# EAGLE design Un_Arduino_old (EAGLE 6.5.0)
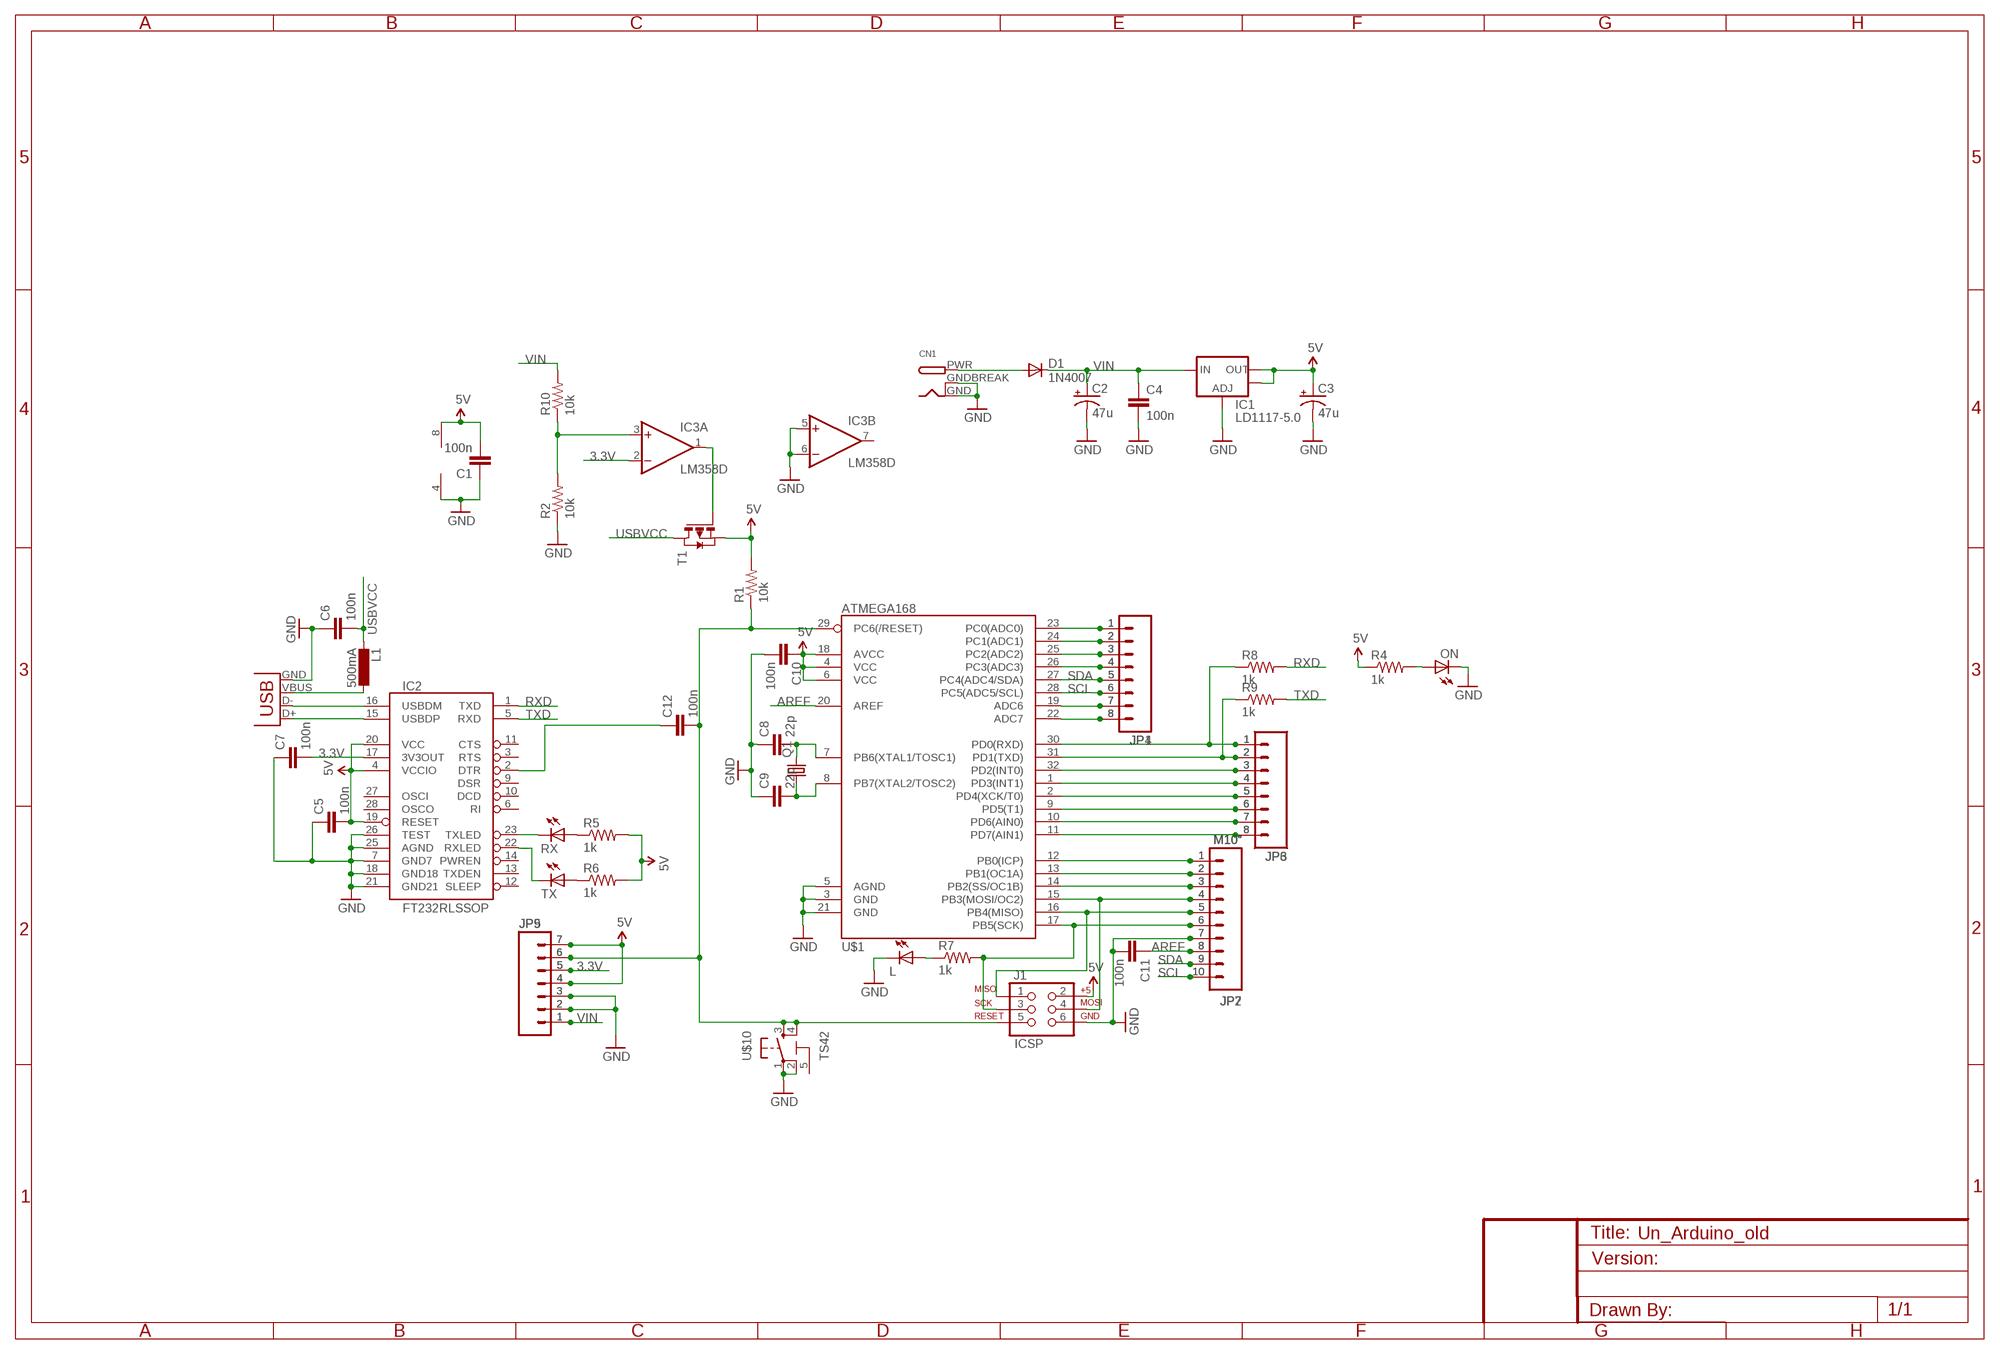
[diagram p0: schematic, sheet 1]

## Parts
C1  100n  CAP0603-CAP  [0603-CAP]
C2  47u  CAP_POLD  [PANASONIC_D]
C3  47u  CAP_POLD  [PANASONIC_D]
C4  100n  CAP0603-CAP  [0603-CAP]
C5  100n  CAP0603-CAP  [0603-CAP]
C6  100n  CAP0603-CAP  [0603-CAP]
C7  100n  CAP0603-CAP  [0603-CAP]
C8  22p  CAP0805  [0805]
C9  22p  CAP0805  [0805]
C10  100n  CAP0603-CAP  [0603-CAP]
C11  100n  CAP0603-CAP  [0603-CAP]
C12  100n  CAP0603-CAP  [0603-CAP]
CN1  DCBARRELPTH  [DCJACK_2MM_PTH]
D1  1N4007  DIODE-SMB  [SMB]
IC1  LD1117-5.0  V_REG_LM1117SOT223  [SOT223]
IC2  FT232RLSSOP  [SSOP28DB]
IC3  LM358D  [SO08]
J1  ICSP  AVR_SPI_PRG_6PTH  [2X3]
JP1  M081X08  [1X08]
JP2  M10"  [1X10]
JP3  M08  [1X08]
JP4  M081X08  [1X08]
JP5  M07  [1X07]
JP6  M08  [1X08]
JP7  M10"  [1X10]
JP9  M07  [1X07]
L  LED0805  [LED-0805]
L1  500mA  L-EUL1812  [L1812]
ON  LED0805  [LED-0805]
Q1  CRYSTALHC49US  [HC49US]
R1  10k  RESISTOR0805-RES  [0805]
R2  10k  RESISTOR0805-RES  [0805]
R4  1k  RESISTOR0805-RES  [0805]
R5  1k  RESISTOR0805-RES  [0805]
R6  1k  RESISTOR0805-RES  [0805]
R7  1k  RESISTOR0805-RES  [0805]
R8  1k  RESISTOR0805-RES  [0805]
R9  1k  RESISTOR0805-RES  [0805]
R10  10k  RESISTOR0805-RES  [0805]
RX  LED0805  [LED-0805]
T1  PMOSSOT23  [SOT-23]
TX  LED0805  [LED-0805]
U$1  ATMEGA168  [TQFP32-08]
U$10  TS42  [TS42]
X1  USBPTH  [USB-B-PTH]

## Nets
3.3V: C7.2 IC2.17(3V3OUT) IC3.2(A:-IN) JP5.5 JP9.5
5V: C1.2 C3.+ C5.2 C10.1 IC1.2(OUT) IC1.4(OUT) IC2.4(VCCIO) IC2.19(RESET) IC2.20(VCC) IC3.8(P:V+) J1.2 JP5.4 JP5.7 JP9.4 JP9.7 R1.2 R4.1 R5.2 R6.2 T1.2(S) U$1.4(VCC) U$1.6(VCC) U$1.18(AVCC)
A0: JP1.1 JP4.1 U$1.23(PC0(ADC0))
AREF: C11.1 JP2.8 JP7.8 U$1.20(AREF)
GND: C1.1 C2.- C3.- C4.2 C5.1 C6.1 C7.1 C8.1 C9.1 C10.2 C11.2 CN1.GND CN1.GNDBREAK IC1.1(ADJ) IC2.7(GND7) IC2.18(GND18) IC2.21(GND21) IC2.25(AGND) IC2.26(TEST) IC3.4(P:V-) IC3.5(B:+IN) IC3.6(B:-IN) J1.6 JP2.7 JP5.2 JP5.3 JP7.7 JP9.2 JP9.3 L.2(C) ON.2(C) R2.1 U$1.3(GND) U$1.5(AGND) U$1.21(GND) U$10.1 U$10.2 X1.GND
IO0: JP3.1 JP6.1 R8.1 U$1.30(PD0(RXD))
N$1: IC3.3(A:+IN) R2.2 R10.1
N$2: IC3.1(A:OUT) T1.3(G)
N$3: L1.1 X1.VBUS
N$4: CN1.PWR D1.A
N$5: IC2.16(USBDM) X1.D-
N$6: IC2.15(USBDP) X1.D+
N$7: R5.1 RX.1(A)
N$8: R6.1 TX.1(A)
N$9: IC2.23(TXLED) RX.2(C)
N$10: IC2.22(RXLED) TX.2(C)
N$12: JP1.7 JP4.7 U$1.19(ADC6)
N$13: JP1.8 JP4.8 U$1.22(ADC7)
N$14: L.1(A) R7.1
N$15: C12.1 IC2.2(DTR)
N$16: JP2.1 JP7.1 U$1.12(PB0(ICP))
N$17: JP2.2 JP7.2 U$1.13(PB1(OC1A))
N$18: JP2.3 JP7.3 U$1.14(PB2(SS/OC1B))
N$19: J1.4 JP2.4 JP7.4 U$1.15(PB3(MOSI/OC2))
N$20: J1.1 JP2.5 JP7.5 U$1.16(PB4(MISO))
N$23: JP3.2 JP6.2 R9.1 U$1.31(PD1(TXD))
N$24: JP3.3 JP6.3 U$1.32(PD2(INT0))
N$25: JP3.4 JP6.4 U$1.1(PD3(INT1))
N$26: JP3.5 JP6.5 U$1.2(PD4(XCK/T0))
N$27: JP3.6 JP6.6 U$1.9(PD5(T1))
N$28: JP3.7 JP6.7 U$1.10(PD6(AIN0))
N$29: JP3.8 JP6.8 U$1.11(PD7(AIN1))
N$31: JP1.2 JP4.2 U$1.24(PC1(ADC1))
N$32: JP1.3 JP4.3 U$1.25(PC2(ADC2))
N$33: JP1.4 JP4.4 U$1.26(PC3(ADC3))
N$34: ON.1(A) R4.2
N$38: C12.2 J1.5 JP5.6 JP9.6 R1.1 U$1.29(PC6(/RESET)) U$10.3 U$10.4
N$39: C8.2 Q1.2 U$1.7(PB6(XTAL1/TOSC1))
N$40: C9.2 Q1.1 U$1.8(PB7(XTAL2/TOSC2))
RXD: IC2.1(TXD) R8.2
SCK: J1.3 JP2.6 JP7.6 R7.2 U$1.17(PB5(SCK))
SCL: JP1.6 JP2.10 JP4.6 JP7.10 U$1.28(PC5(ADC5/SCL))
SDA: JP1.5 JP2.9 JP4.5 JP7.9 U$1.27(PC4(ADC4/SDA))
TXD: IC2.5(RXD) R9.2
USBVCC: C6.2 L1.2 T1.1(D)
VIN: C2.+ C4.1 D1.C IC1.3(IN) JP5.1 JP9.1 R10.2
Unconnected: IC2.3(RTS) IC2.6(RI) IC2.9(DSR) IC2.10(DCD) IC2.11(CTS) IC2.12(SLEEP) IC2.13(TXDEN) IC2.14(PWREN) IC2.27(OSCI) IC2.28(OSCO) IC3.7(B:OUT) U$10.5

## Library data of the parts
C1 C4-C12 = 1SparkFun:CAP: Capacitor Standard 0603 ceramic capacitor, and 0.1" leaded capacitor.
C2 C3 = 1SparkFun:CAP_POL: Capacitor Polarized These are standard SMD and PTH capacitors. Normally 10uF, 47uF, and 100uF in electrolytic and tantalum varieties. Always verify the external diameter of the through hole cap, it varies with capacity, voltage, and manufacturer. The EIA devices should be standard.
CN1 = 1adafruit:DCBARREL: 2.0mm DC Barrel Jack DCJACK_2MM_PTH - Through Hole Jack (4UConnector: 05537)
D1 = diode:DIODE-: DIODE
IC1 = 1SparkFun:V_REG_LM1117: Voltage Regulator LM1117 Standard adjustable voltage regulator but in SMD form. Spark Fun Electronics SKU : COM-00595
IC2 = 1SparkFun:FT232RL: USB UART FT232RL 4th Generation USB UART (USB <-> Serial) Controller. Spark Fun Electronics SKU : COM-00650
IC3 = linear:LM358: OP AMP also LM158; LM258; LM2904 Source: http://cache.national.com/ds/LM/LM158.pdf
J1 = 1SparkFun:AVR_SPI_PRG_6: AVR ISP 6 Pin This is the reduced ISP connector for AVR programming. Common on Arduino. This footprint will take up less PCB space and can be used with a 10-pin to 6-pin adapter such as SKU: BOB-08508
JP1 JP4 = 2SparkFun:M08: Header 8 Standard 8-pin 0.1" header. Use with straight break away headers (SKU : PRT-00116), right angle break away headers (PRT-00553), swiss pins (PRT-00743), machine pins (PRT-00117), and female headers (PRT-00115).
JP2 JP7 = 1SparkFun:M10: Header 10 Standard 10-pin 0.1" header. Use with straight break away headers (SKU : PRT-00116), right angle break away headers (PRT-00553), swiss pins (PRT-00743), machine pins (PRT-00117), and female headers (PRT-00115).
JP3 JP6 = 1SparkFun:M08: Header 8 Standard 8-pin 0.1" header. Use with straight break away headers (SKU : PRT-00116), right angle break away headers (PRT-00553), swiss pins (PRT-00743), machine pins (PRT-00117), and female headers (PRT-00115).
JP5 JP9 = 2SparkFun:M07: Header 7 Standard 7-pin 0.1" header. Use with straight break away headers (SKU : PRT-00116), right angle break away headers (PRT-00553), swiss pins (PRT-00743), machine pins (PRT-00117), and female headers (PRT-00115). NOTES ON THE VARIANTS LOCK and LOCK_LONGPADS... This footprint was designed to help hold the alignment of a through-hole component (i.e. 7-pin header) while soldering it into place. You may notice that each hole has been shifted either up or down by 0.005 of an inch from it's more standard position (which is usually a perfectly straight line). This slight alteration caused the pins (the squares in the middle) to touch the edges of the holes. Because they are alternating, it causes a "brace" to hold the header in place. 0.005 has proven to be the perfect amount of "off-center" position when using our standard breakaway headers. Although looks a little odd when you look at the bare footprint, once you have a header in there, the alteration is very hard to notice. Also, if you push a header all the way into place, it is covered up entirely on the bottom side. This idea of altering the position of holes to aid alignment will be further integrated into the Sparkfun Library for other footprints. It can help hold any component with 3 or more connection pins.
L ON RX TX = 1SparkFun:LED: LEDs Standard schematic elements and footprints for 5mm, 3mm, 1206, and 0603 sized LEDs. 5mm - Spark Fun Electronics SKU : COM-00529 (and others)
L1 = rcl:L-EU: INDUCTOR, European symbol
Q1 = 1SparkFun:CRYSTAL: Crystals Various standard crystals. Proven footprints. Spark Fun Electronics SKU : COM-00534
R1 R2 R4-R10 = 2SparkFun:RESISTOR: Resistor Basic schematic elements and footprints for 0603, 1206, and PTH resistors.
T1 = zetex:PMOSSOT23: MOS FET; OC_FARNELL: unknown; OC_NEWARK: unknown
U$1 = 1SparkFun:ATMEGA168
U$10 = 2SparkFun:TS42
X1 = 1SparkFun:USB: USB Connectors USB-B-PTH is fully proven SKU : PRT-00139 USB-miniB is fully proven SKU : PRT-00587 USB-A-PCB is untested. USB-A-H is throughly reviewed, but untested. Spark Fun Electronics SKU : PRT-00437 USB-B-SMT is throughly reviewed, but untested. Needs silkscreen touching up. USB-A-S has not been used/tested USB-MB-H has not been used/tested

## Net classes
0 default: width 0.254 mm, clearance 0.254 mm
1 power: width 0.61 mm, drill 0.61 mm, clearance 0.254 mm
2 gnd: width 0.305 mm, drill 0.559 mm, clearance 0.254 mm
3 usbvcc: width 0.508 mm, drill 0.61 mm, clearance 0.254 mm
4 aref: width 0.406 mm, drill 0.61 mm, clearance 0.254 mm

## Board
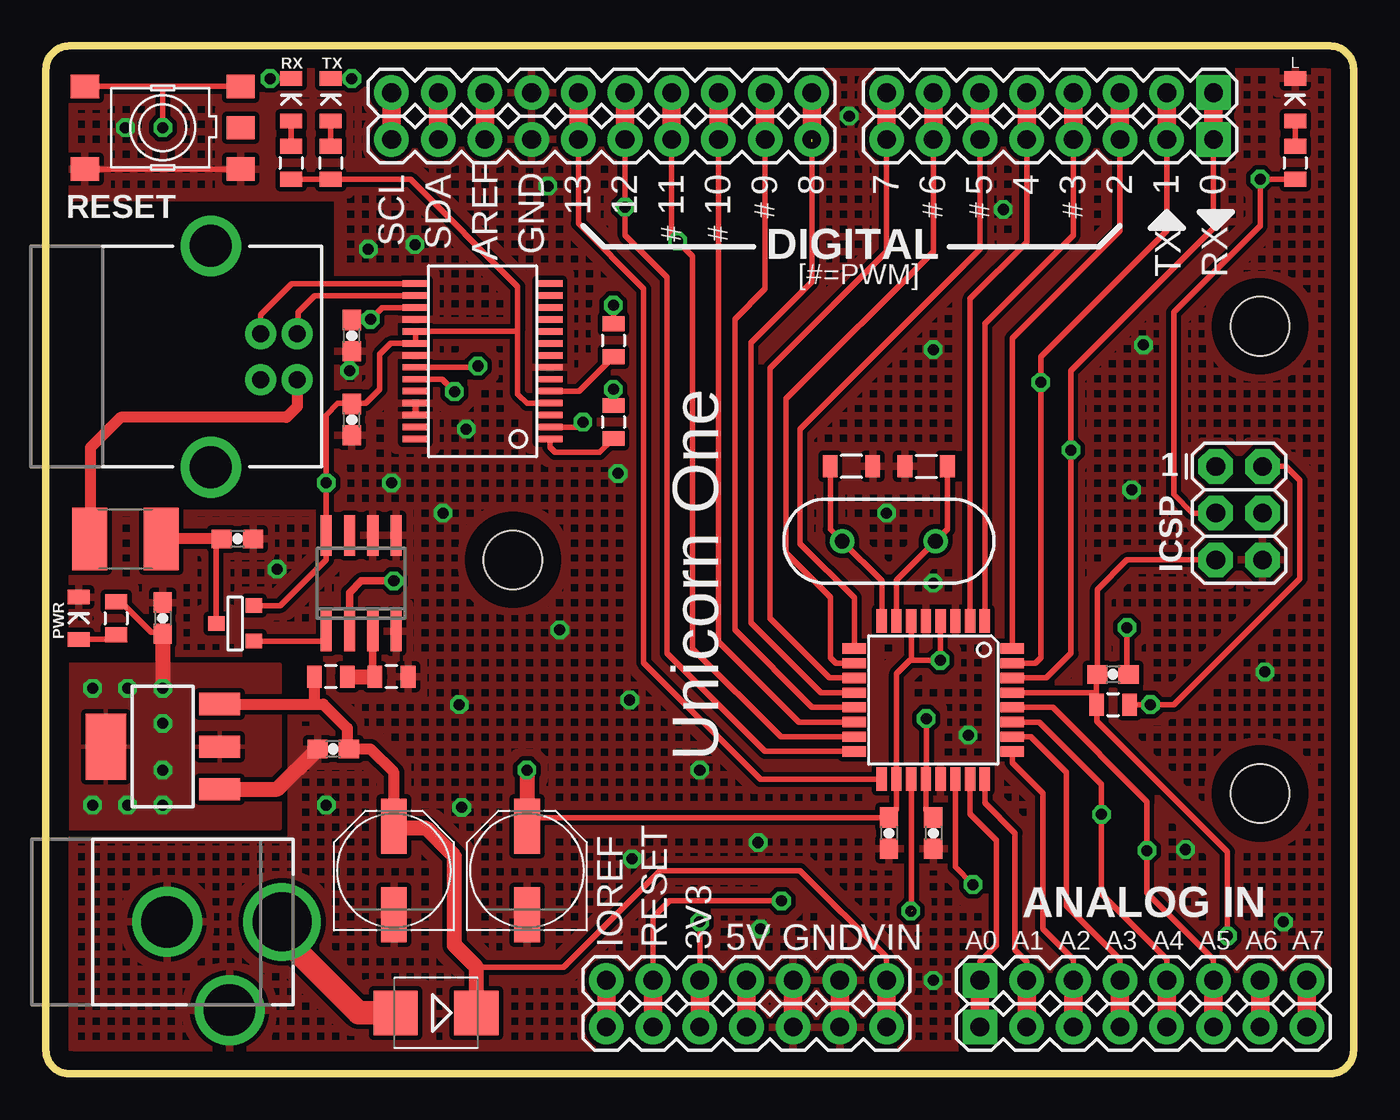
[diagram p1: board, top side]
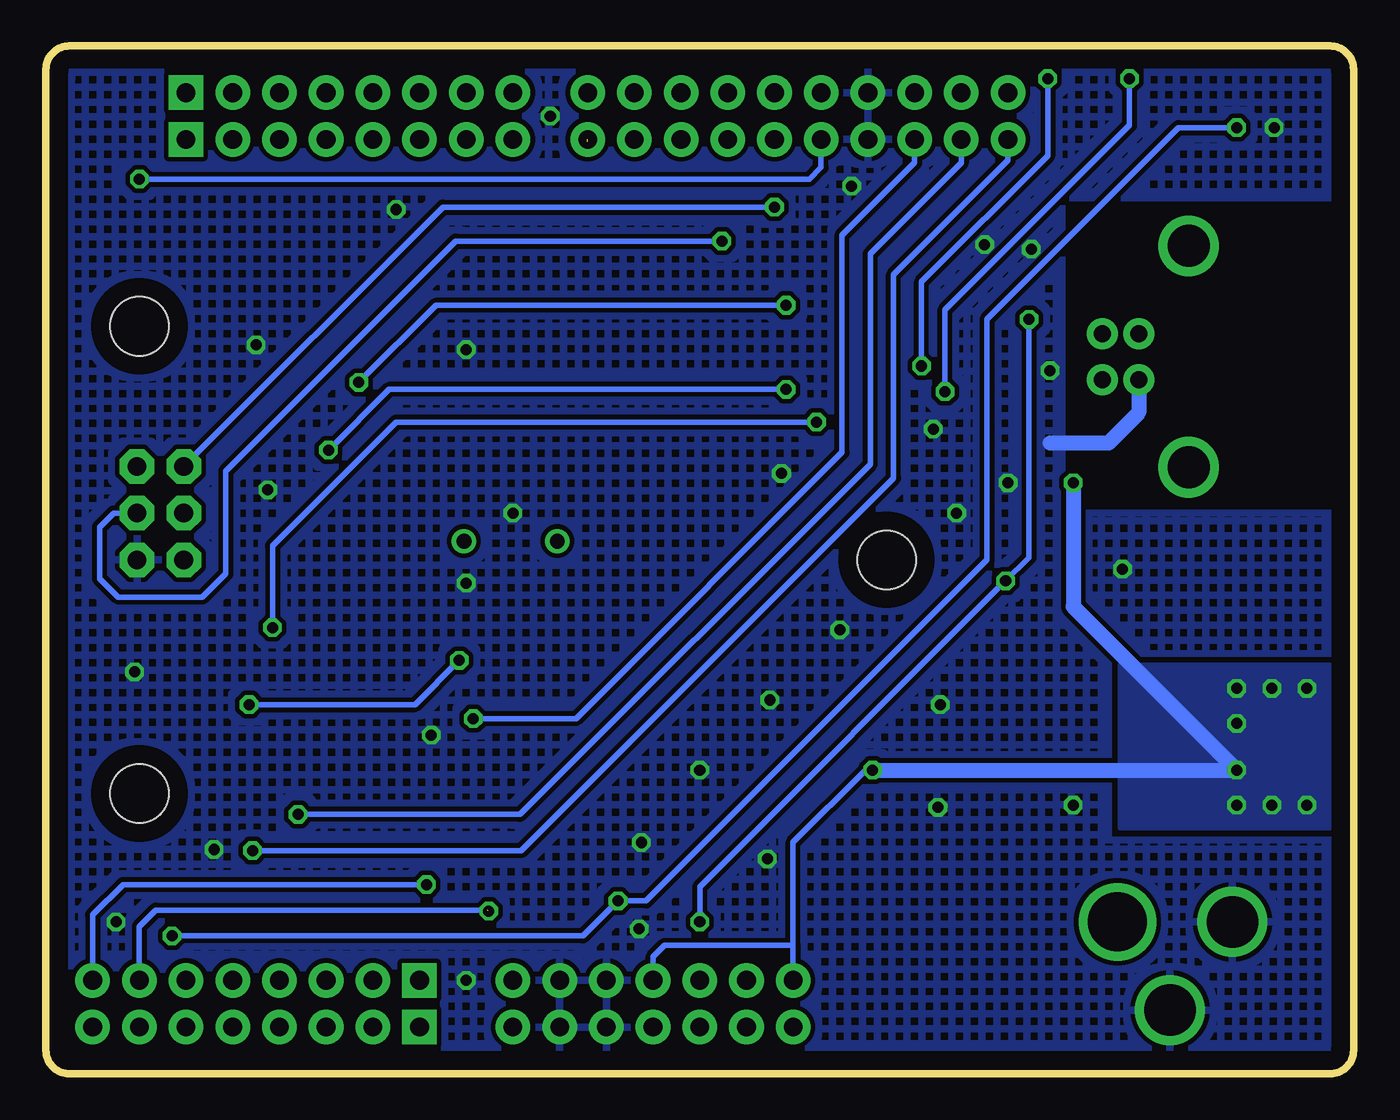
[diagram p2: board, bottom side, seen from below]

Size 71.12 x 55.88 mm. Coordinates in mm from the lower left corner, seen from the top.
Outline: 1.27,0 69.85,0 arc90 71.12,1.27 71.12,54.61 arc90 69.85,55.88 1.27,55.88 arc90 0,54.61 0,1.27 arc90 1.27,0
Copper layers (1*16): Top 0.035mm / dielectric 1.5mm / Bottom 0.035mm
Design rules "default": minimum track width 10mil, minimum drill 24mil, track to track 8mil, track to pad 8mil, pad to pad 8mil, via to via 8mil, smd to smd 8mil, copper to edge 40mil, drill to drill 8mil, minimum pad ring 10mil, minimum via ring 8mil, stop-mask expansion 4mil, vias tented up to drill 0mil, thermal gap 10mil
Holes 3.2 mm at 66.04,40.64 66.04,15.24 25.4,27.94

### Footprints (pad centres in the part's own frame; a part is rotated, then mirrored left to right if it is on the bottom)
0603-CAP = smd 1.1 x 1: 1 -0.85,0; 2 0.85,0
PANASONIC_D = smd 3 x 1.4: + 2.4,0; - -2.4,0
0805 = smd 0.8 x 1.2: 1 -1.154,0; 2 1.154,0
DCJACK_2MM_PTH = drill 2.8: GND 0,7.35; GNDBREAK 4.8,10.75 | drill 3.2: PWR 0,13.6
SMB = smd 2.4 x 2.4: A 2.2,0; C -2.2,0
SOT223 = smd 1.219 x 2.235: 1 -2.311,-3.099; 2 0,-3.099; 3 2.311,-3.099 | smd 3.6 x 2.2: 4 0,3.099
SSOP28DB = smd 0.348 x 1.397: 1 -4.225,-3.656; 2 -3.575,-3.656; 3 -2.925,-3.656; 4 -2.275,-3.656; 5 -1.625,-3.656; 6 -0.975,-3.656; 7 -0.325,-3.656; 8 0.325,-3.656; 9 0.975,-3.656; 10 1.625,-3.656; 11 2.275,-3.656; 12 2.925,-3.656; 13 3.575,-3.656; 14 4.225,-3.656; 15 4.225,3.656; 16 3.575,3.656; 17 2.925,3.656; 18 2.275,3.656; 19 1.625,3.656; 20 0.975,3.656; 21 0.325,3.656; 22 -0.325,3.656; 23 -0.975,3.656; 24 -1.625,3.656; 25 -2.275,3.656; 26 -2.925,3.656; 27 -3.575,3.656; 28 -4.225,3.656
SO08 = smd 0.6 x 2.2: 1 -1.905,-2.6; 2 -0.635,-2.6; 3 0.635,-2.6; 4 1.905,-2.6; 5 1.905,2.6; 6 0.635,2.6; 7 -0.635,2.6; 8 -1.905,2.6
2X3 = drill 1.016 pad 1.88 octagon: 1 0,0; 2 0,2.54; 3 2.54,0; 4 2.54,2.54; 5 5.08,0; 6 5.08,2.54
1X08 = drill 1.016 pad 1.88 square: 1 0,0 | drill 1.016 pad 1.88: 2 2.54,0; 3 5.08,0; 4 7.62,0; 5 10.16,0; 6 12.7,0; 7 15.24,0; 8 17.78,0
1X10 = drill 1.016 pad 1.88: 1 0,0; 2 2.54,0; 3 5.08,0; 4 7.62,0; 5 10.16,0; 6 12.7,0; 7 15.24,0; 8 17.78,0; 9 20.32,0; 10 22.86,0
1X07 = drill 1.016 pad 1.88: 1 0,0; 2 2.54,0; 3 5.08,0; 4 7.62,0; 5 10.16,0; 6 12.7,0; 7 15.24,0
LED-0805 = smd 0.8 x 1.2: 1 -1.154,0; 2 1.154,0
L1812 = smd 1.9 x 3.4: 1 -1.95,0; 2 1.95,0
HC49US = drill 0.813: 1 -2.54,0; 2 2.54,0
0805' = smd 0.8 x 1.2: 1 -0.9,0; 2 0.9,0
SOT-23 = smd 0.787 x 0.889: 1 0.025,-1.016; 2 -0.94,1.016; 3 0.991,1.016
TQFP32-08 = smd 1.27 x 0.559: 1 -4.293,2.8; 2 -4.293,2; 3 -4.293,1.2; 4 -4.293,0.4; 5 -4.293,-0.4; 6 -4.293,-1.2; 7 -4.293,-2; 8 -4.293,-2.8; 17 4.293,-2.8; 18 4.293,-2; 19 4.293,-1.2; 20 4.293,-0.4; 21 4.293,0.4; 22 4.293,1.2; 23 4.293,2; 24 4.293,2.8 | smd 0.559 x 1.27: 9 -2.8,-4.293; 10 -2,-4.293; 11 -1.2,-4.293; 12 -0.4,-4.293; 13 0.4,-4.293; 14 1.2,-4.293; 15 2,-4.293; 16 2.8,-4.293; 25 2.8,4.293; 26 2,4.293; 27 1.2,4.293; 28 0.4,4.293; 29 -0.4,4.293; 30 -1.2,4.293; 31 -2,4.293; 32 -2.8,4.293
TS42 = smd 1.524 x 1.27: 1 -4.229,2.25; 2 4.229,2.25; 3 -4.229,-2.25; 4 4.229,-2.25; 5 -4.229,-0.002
USB-B-PTH = drill 0.914 pad 1.676: D+ 0,1.25; D- 1.981,1.25; GND 0,-1.25; VBUS 1.981,-1.25 | drill 2.286: P$1 -2.718,-6.02; P$2 -2.718,6.02

### Placement (x,y rotation side)
C1  6.35,24.77 270 top
C2  18.92,11.05 90 top
C3  26.16,11.05 90 top
C4  15.62,17.65 180 top
C5  16.64,35.56 90 top
C6  10.41,29.08 180 top
C7  16.64,40.13 90 top
C8  47.88,33.02 0 top
C9  43.81,33.02 180 top
C10  45.85,13.08 270 top
C11  48.26,13.08 270 top
C12  58.04,21.72 180 top
CN1  -0.76,8.26 270 top
D1  21.21,3.3 180 top
IC1  6.35,17.78 90 top
IC2  23.75,38.73 90 top
IC3  17.14,26.67 0 top
J1  63.63,33.02 270 top
JP1  50.8,5.08 0 top
JP2  41.66,53.34 180 top
JP3  63.5,53.34 180 top
JP4  50.8,2.54 0 top
JP5  45.72,2.54 180 top
JP6  63.5,50.8 180 top
JP7  41.66,50.8 180 top
JP9  45.72,5.08 180 top
L  67.94,52.96 90 top
L1  4.32,29.08 0 top
ON  1.78,24.77 90 top
Q1  45.85,28.96 0 top
R1  10k  [0805']  58.04,20.07 0 top
R2  10k  [0805']  18.8,21.59 180 top
R4  1k  [0805']  3.81,24.77 270 top
R5  1k  [0805']  13.33,49.53 270 top
R6  1k  [0805']  15.49,49.53 270 top
R7  1k  [0805']  67.94,49.53 270 top
R8  1k  [0805']  30.86,35.43 270 top
R9  1k  [0805']  30.86,39.88 270 top
R10  10k  [0805']  15.49,21.59 180 top
RX  13.33,52.96 90 top
T1  10.29,24.51 270 top
TX  15.49,52.96 90 top
U$1  48.26,20.32 270 top
U$10  6.35,51.44 180 top
X1  11.68,38.99 0 top

### Tracks (layer width: path | path; a pad name or v marks a point on that pad's centre or on a via)
3.3V  (via drill 0.6)
  Top 0.305: 16.68,40.77 C7.2 16.68,41.02 v17.65,41.02 18.29,41.66 IC2.17 | v35.56,8.26 JP9.5
  Top 0.406: IC3.2 16.51,26.16 17.14,26.8 v18.92,26.8
  Top 1.016: JP5.5 JP9.5
  Bottom 0.305: v17.65,41.02 17.65,28.07 v18.92,26.8 35.56,10.16 v35.56,8.26
5V  (via drill 0.6)
  Top 0.305: R4.1 4.05,25.66 5.72,24 6.26,24 C1.2 | T1.2 12.75,25.45 15.24,27.94 IC3.8 v15.24,32.13 15.24,35.81 15.88,36.45 16.68,36.45 | R5.2 15.23,48.63 | 15.23,48.63 15.37,48.77 | 20.09,39.78 IC2.19 25.5,40.36 arc90 25.65,40.51 | 20.09,39.78 20.07,39.75 | R1.2 v60.07,20.07 61.34,20.07 68.2,26.92 68.2,32.26 67.44,33.02 J1.2 | 48.64,24.51 v48.64,22.48 46.99,22.48 | 48.64,24.51 48.64,24.64 | 46.99,22.48 46.26,21.75 U$1.18 46.26,14.34 C10.1 26.64,13.93 C3.+ | U$1.6 47.06,22.55 46.99,22.48 | 25.65,40.51 25.65,42.8 19.82,48.63 R6.2 15.23,48.63 | IC2.4 27.39,36.45 26.16,36.45 25.65,36.96 25.65,40.51 | 16.68,36.45 17.4,36.45 18.16,37.21 18.16,39.12 18.75,39.71 IC2.20 20.09,39.78 | 16.68,36.45 C5.2 | U$1.4 48.66,24.53 48.64,24.51
  Top 0.813: C1.2 v6.35,20.95 | v26.16,16.51 C3.+
  Top 1.016: JP5.7 JP9.7 | JP5.4 JP9.4
  Bottom 0.305: v60.07,20.07 51.05,20.07 v48.64,22.48 | 30.48,6.99 30.48,12.57 26.54,16.51 v26.16,16.51 | 30.48,6.99 37.47,6.99 38.1,6.35 JP9.4 | 30.48,6.99 JP9.7
  Bottom 0.813: 6.73,16.89 v6.35,16.51 | v15.24,32.13 15.24,25.4 v6.35,16.51 | v26.16,16.51 v6.35,16.51
  other vias: 2.54,20.95 4.44,20.95 6.35,19.05 6.35,14.61 4.44,14.61 2.54,14.61
  pour Bottom: 1.27,22.23 12.7,22.23 12.7,13.34 1.27,13.34
  pour Top: 1.27,13.34 12.7,13.34 12.7,22.23 1.27,22.23
A0
  Top 0.305: U$1.23 50.26,14.13 51.69,12.7 51.69,6.99 50.8,6.1 JP1.1
  Top 1.016: JP1.1 JP4.1
AREF  (via drill 0.6)
  Top 0.305: v47.88,19.3 47.88,15.51 47.86,15.49 | C11.1 47.86,14.33 47.86,15.49 | 47.86,15.49 U$1.20
  Top 1.016: JP2.8 JP7.8
  Bottom 0.305: v47.88,19.3 42.29,19.3 27.81,33.78 27.81,45.59 23.88,49.53 JP7.8
GND  (via drill 0.6)
  Top 0.305: IC2.25 IC2.26 | v16.51,38.23 16.51,39.12 16.64,39.24 | U$10.2 U$10.1
  Top 0.813: IC1.1 12.59,15.47 C4.2
  Top 1.016: JP5.2 JP9.2 | JP5.3 JP9.3
  Bottom 0.813: X1.GND 11.68,35.94 13.33,34.29 16.51,34.29
  other vias: 18.8,32.13 38.73,12.57 38.86,7.87 31.75,20.32 27.94,24.13 21.59,30.48 27.31,48.26 48.26,39.37 52.07,46.99 45.72,30.48 59.69,39.62 59.06,31.75 66.29,21.84 22.48,20.07 31.11,32.64 48.26,26.67 50.17,18.41 48.26,5.08 22.86,35.05 17.53,44.83 31.88,11.68 15.24,14.61 22.61,14.48 35.56,16.51 12.57,27.43 20.07,45.09 43.69,52.07 4.32,51.44 67.31,8.26 61.98,12.19
  pour Top (hatched): 0,55.88 71.12,55.88 71.12,0 0,0 0,12.7 13.33,12.7 13.33,22.86 0,22.86 0,30.48 15.88,30.48 15.88,47.62 0,47.62
  pour Bottom (hatched): 0,55.88 71.12,55.88 71.12,0 0,0 0,12.7 13.33,12.7 13.33,22.86 0,22.86 0,30.48 15.88,30.48 15.88,47.62 0,47.62
IO0  (via drill 0.6)
  Top 0.305: U$1.30 54.41,21.52 55.75,22.86 v55.75,33.91 55.75,38.23 63.5,45.97 JP6.1 | R8.1 v30.86,37.21
  Top 1.016: JP3.1 JP6.1
  Bottom 0.305: v30.86,37.21 52.45,37.21 v55.75,33.91
N$1
  Top 0.406: IC3.3 17.78,21.71 R2.2
  Top 0.813: R10.1 R2.2
N$2
  Top 0.305: T1.3 15.34,23.52 15.37,23.5 15.37,23.94 IC3.1
N$3
  Top 0.61: X1.VBUS 13.67,36.27 13.08,35.69 4.06,35.69 2.41,34.04 2.41,29.13 L1.1
N$4
  Top 1.27: D1.A 17.02,3.3 12.84,7.48 CN1.PWR
N$5
  Top 0.305: IC2.16 14.62,42.31 13.72,41.4 13.72,40.29 X1.D-
N$6
  Top 0.305: IC2.15 13.37,42.96 11.68,41.27 X1.D+
N$7
  Top 0.305: RX.1 R5.1
N$8
  Top 0.305: R6.1 TX.1
N$9  (via drill 0.6)
  Top 0.305: RX.2 12.2,54.11 v12.19,54.1 | IC2.23 21.55,37.76 v22.22,37.08
  Bottom 0.305: v12.19,54.1 12.19,51.56 22.22,41.53 v22.22,37.08
N$10  (via drill 0.6)
  Top 0.305: TX.2 16.5,54.11 v16.64,54.1 | IC2.22 23.42,38.41 v23.5,38.48
  Bottom 0.305: v16.64,54.1 16.64,49.91 23.5,43.05 v23.5,38.48
N$12  (via drill 0.6)  (1 unrouted)
  Top 0.305: U$1.19 47.06,8.86 v47.04,8.84
  Top 1.016: JP1.7 JP4.7
  Bottom 0.305: JP1.7 66.04,8 65.15,8.89 47.12,8.89
N$13  (via drill 0.6)
  Top 0.305: U$1.22 49.46,11.25 v50.42,10.29
  Top 1.016: JP1.8 JP4.8
  Bottom 0.305: v50.42,10.29 66.93,10.29 68.58,8.64 JP1.8
N$14
  Top 0.305: L.1 R7.1
N$15  (via drill 0.6)
  Top 0.305: IC2.2 28.94,35.16 v29.21,35.43 | v58.8,24.26 58.8,21.72 C12.1
  Bottom 0.305: v58.8,24.26 58.8,28.7 52.07,35.43 v29.21,35.43
N$16  (1 unrouted)
  Top 0.305: 41.91,50.93 41.66,50.67 41.66,43.05 38.35,39.75 38.35,24.51 42.14,20.72 U$1.12
  Top 1.016: JP2.1 JP7.1
N$17
  Top 0.305: JP7.2 39.12,42.67 37.47,41.02 37.47,24.13 41.66,19.94 43.95,19.94 U$1.13
  Top 1.016: JP2.2 JP7.2
N$18
  Top 0.305: U$1.14 40.95,19.12 36.58,23.5 JP7.3
  Top 1.016: JP2.3 JP7.3
N$19  (via drill 0.6)
  Top 0.305: U$1.15 39.97,18.32 35.18,23.11 35.18,44.45 v34.35,45.28 34.04,45.59 JP7.4
  Top 1.016: JP2.4 JP7.4
  Bottom 0.305: v34.35,45.28 48.83,45.28 61.34,32.77 61.34,27.18 62.61,25.91 67.18,25.91 68.2,26.92 68.2,29.72 67.44,30.48 J1.4
N$20  (via drill 0.6)
  Top 0.305: 43.97,17.5 43.94,17.53 39.12,17.53 33.78,22.86 33.78,43.31 31.5,45.59 v31.5,47.12 JP7.5 | U$1.16 43.97,17.5 | 43.97,17.5 44.07,17.4
  Top 1.016: JP2.5 JP7.5
  Bottom 0.305: v31.5,47.12 49.53,47.12 J1.1
N$23  (via drill 0.6)
  Top 0.305: U$1.31 53.82,22.32 54.1,22.61 v54.1,37.59 54.1,38.99 60.96,45.85 JP6.2 | R9.1 v30.86,41.78
  Top 1.016: JP3.2 JP6.2
  Bottom 0.305: v30.86,41.78 49.91,41.78 v54.1,37.59
N$24
  Top 0.305: U$1.32 52.55,39.98 58.42,45.85 JP6.3
  Top 1.016: JP3.3 JP6.3
N$25
  Top 0.305: U$1.1 51.06,40.77 55.88,45.59 JP6.4
  Top 1.016: JP3.4 JP6.4
N$26
  Top 0.305: U$1.2 50.26,42.13 53.34,45.21 JP6.5
  Top 1.016: JP3.5 JP6.5
N$27
  Top 0.305: U$1.9 43.97,25.88 41.02,28.83 41.02,35.05 50.8,44.83 JP6.6
  Top 1.016: JP3.6 JP6.6
N$28
  Top 0.305: U$1.10 42.96,22.32 42.67,22.61 42.67,25.91 40.26,28.32 40.26,36.7 48.26,44.7 JP6.7
  Top 1.016: JP3.7 JP6.7
N$29
  Top 0.305: U$1.11 42.61,21.52 39.37,24.77 39.37,38.35 45.72,44.7 JP6.8
  Top 1.016: JP3.8 JP6.8
N$31
  Top 0.305: U$1.24 51.06,14.73 52.7,13.08 52.7,6.73 53.34,6.1 JP1.2
  Top 1.016: JP4.2 JP1.2
N$32
  Top 0.305: U$1.25 52.55,16.92 54.23,15.24 54.23,7.87 55.88,6.22 JP1.3
  Top 1.016: JP1.3 JP4.3
N$33
  Top 0.305: U$1.26 53.56,18.32 55.5,16.38 55.5,9.14 58.42,6.22 JP1.4
  Top 1.016: JP4.4 JP1.4
N$34
  Top 0.305: ON.1 3.56,23.61 R4.2
N$38  (via drill 0.6)
  Top 0.305: 57.14,20.7 R1.1 57.15,20.05 57.15,19.18 64.26,12.06 v64.26,7.49 | 57.14,20.7 57.14,21.67 C12.2 57.19,26.33 58.8,27.94 J1.5 | U$1.29 57.12,20.72 57.14,20.7 | v40,9.4 33.91,9.4 33.02,8.51 JP9.6 | U$10.4 U$10.3 6.35,53.69 v6.35,51.44
  Top 1.016: JP5.6 JP9.6
  Bottom 0.305: v64.26,7.49 41.91,7.49 v40,9.4 38.48,9.4 19.94,27.94 19.94,41.02 9.53,51.44 v6.35,51.44
N$39
  Top 0.305: U$1.7 46.26,26.83 Q1.2 49.03,29.6 C8.2
N$40
  Top 0.305: U$1.8 45.46,26.8 Q1.1 42.66,29.6 C9.2
RXD
  Top 0.305: IC2.1 27.41,34.06 27.69,33.78 30.11,33.78 R8.2
SCK  (via drill 0.6)
  Top 0.305: 45.34,16 38.86,16 32.51,22.35 32.51,42.67 28.96,46.23 JP7.6 | 45.34,16 45.47,16 | R7.2 v66.05,48.63 v66.04,48.64 66.04,46.1 61.34,41.4 61.34,31.5 62.36,30.48 J1.3 | U$1.17 45.36,16.03 45.34,16
  Top 1.016: JP2.6 JP7.6
  Bottom 0.305: v66.04,48.64 29.59,48.64 28.96,49.28 JP7.6
SCL  (via drill 0.6)
  Top 0.305: U$1.28 54.76,19.92 59.88,14.8 v59.88,12.13 59.88,9.84 63.5,6.22 JP1.6
  Top 1.016: JP2.10 JP7.10 | JP1.6 JP4.6
  Bottom 0.305: v59.88,12.13 45.28,12.13 25.02,32.38 25.02,43.43 18.8,49.66 JP7.10
SDA  (via drill 0.6)
  Top 0.305: U$1.27 54.03,19.12 57.4,15.75 v57.4,14.1 57.4,9.78 60.96,6.22 JP1.5
  Top 1.016: JP2.9 JP7.9 | JP1.5 JP4.5
  Bottom 0.305: v57.4,14.1 45.34,14.1 26.29,33.15 26.29,44.58 21.34,49.53 JP7.9
TXD
  Top 0.305: IC2.5 28.99,37.11 R9.2
USBVCC
  Top 0.305: T1.1 9.27,28.66 C6.2
  Top 0.61: C6.2 L1.2
VIN
  Top 0.305: 23.41,5.8 28.15,5.8 33.4,11.05 41.02,11.05 45.72,6.35 JP9.1
  Top 0.61: C2.+ 18.92,16.38 17.65,17.65 C4.1 16.38,17.74 16.38,18.8 15.09,20.09 14.73,20.09 | IC1.3 14.73,20.09 | R10.2 14.59,20.23 14.73,20.09
  Top 0.813: D1.C 23.41,5.8 22.22,6.99 22.22,11.81 20.7,13.34 19.04,13.34 C2.+
  Top 1.016: JP5.1 JP9.1

### Text on the board
tPlace: 13 | 12 | 11 | 10 | 9 | 8 | 7 | 6 | 5 | 4 | 3 | 2 | 1 | 0 | Unicorn One
tNames: RX | TX | AREF | SCL | SDA | GND | RESET | # | # | # | # | # | # | DIGITAL | [#=PWM] | TX | RX | 1 | ICSP | PWR | ANALOG IN | IOREF | RESET | 3V3 | 5V | GND | VIN | A0 | A1 | A2 | A3 | A4 | A5 | A6 | A7